# Altium schematic sheet Beaglebone.SchDoc
size A
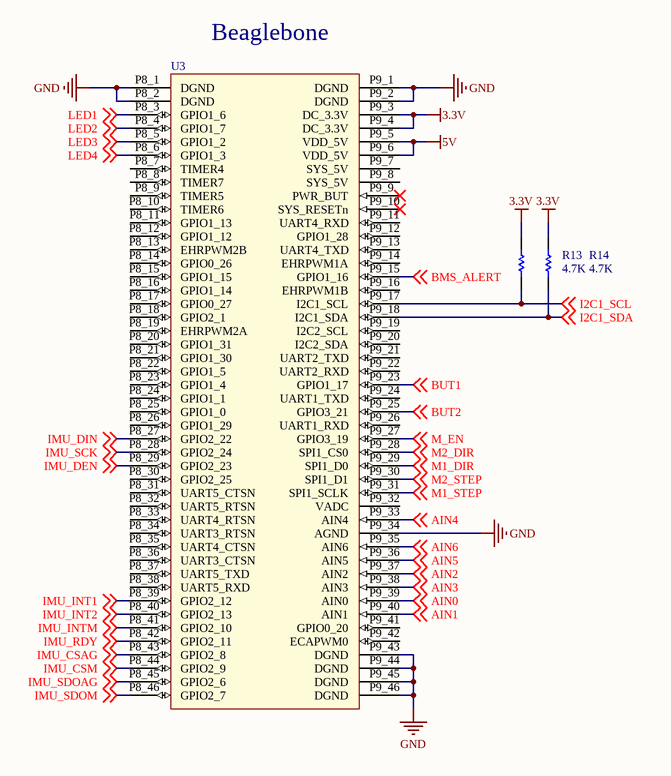
[diagram p0: Beaglebone.SchDoc]

## Parts
R13  value 4.7K  [J1-0603]
R14  value 4.7K  [J1-0603]
U3  Beaglebone Black  [BEAGLEBONE_BLACK]  (value not drawn)

## Nets
3.3V: R13.2 R14.2 U3.P9_3(DC_3.3V) U3.P9_4(DC_3.3V)
5V: U3.P9_5(VDD_5V) U3.P9_6(VDD_5V)
GND: U3.P8_1(DGND) U3.P8_2(DGND) U3.P9_1(DGND) U3.P9_2(DGND) U3.P9_34(AGND) U3.P9_43(DGND) U3.P9_44(DGND) U3.P9_45(DGND) U3.P9_46(DGND)
AIN0: U3.P9_39(AIN0) ; off-sheet AIN0
AIN1: U3.P9_40(AIN1) ; off-sheet AIN1
AIN2: U3.P9_37(AIN2) ; off-sheet AIN2
AIN3: U3.P9_38(AIN3) ; off-sheet AIN3
AIN4: U3.P9_33(AIN4) ; off-sheet AIN4
AIN5: U3.P9_36(AIN5) ; off-sheet AIN5
AIN6: U3.P9_35(AIN6) ; off-sheet AIN6
BMS_ALERT: U3.P9_15(GPIO1_16) ; off-sheet BMS_ALERT
BUT1: U3.P9_23(GPIO1_17) ; off-sheet BUT1
BUT2: U3.P9_25(GPIO3_21) ; off-sheet BUT2
I2C1_SCL: R13.1 U3.P9_17(I2C1_SCL) ; off-sheet I2C1_SCL
I2C1_SDA: R14.1 U3.P9_18(I2C1_SDA) ; off-sheet I2C1_SDA
IMU_CSAG: U3.P8_43(GPIO2_8) ; off-sheet IMU_CSAG
IMU_CSM: U3.P8_44(GPIO2_9) ; off-sheet IMU_CSM
IMU_DEN: U3.P8_29(GPIO2_23) ; off-sheet IMU_DEN
IMU_DIN: U3.P8_27(GPIO2_22) ; off-sheet IMU_DIN
IMU_INT1: U3.P8_39(GPIO2_12) ; off-sheet IMU_INT1
IMU_INT2: U3.P8_40(GPIO2_13) ; off-sheet IMU_INT2
IMU_INTM: U3.P8_41(GPIO2_10) ; off-sheet IMU_INTM
IMU_RDY: U3.P8_42(GPIO2_11) ; off-sheet IMU_RDY
IMU_SCK: U3.P8_28(GPIO2_24) ; off-sheet IMU_SCK
IMU_SDOAG: U3.P8_45(GPIO2_6) ; off-sheet IMU_SDOAG
IMU_SDOM: U3.P8_46(GPIO2_7) ; off-sheet IMU_SDOM
LED1: U3.P8_3(GPIO1_6) ; off-sheet LED1
LED2: U3.P8_4(GPIO1_7) ; off-sheet LED2
LED3: U3.P8_5(GPIO1_2) ; off-sheet LED3
LED4: U3.P8_6(GPIO1_3) ; off-sheet LED4
M1_DIR: U3.P9_29(SPI1_D0) ; off-sheet M1_DIR
M1_STEP: U3.P9_31(SPI1_SCLK) ; off-sheet M1_STEP
M2_DIR: U3.P9_28(SPI1_CS0) ; off-sheet M2_DIR
M2_STEP: U3.P9_30(SPI1_D1) ; off-sheet M2_STEP
M_EN: U3.P9_27(GPIO3_19) ; off-sheet M_EN

Not connected (* = marked no-connect by the designer): U3 P8_7(TIMER4) P8_8(TIMER7) P8_9(TIMER5) P8_10(TIMER6) P8_11(GPIO1_13) P8_12(GPIO1_12) P8_13(EHRPWM2B) P8_14(GPIO0_26) P8_15(GPIO1_15) P8_16(GPIO1_14) P8_17(GPIO0_27) P8_18(GPIO2_1) P8_19(EHRPWM2A) P8_20(GPIO1_31) P8_21(GPIO1_30) P8_22(GPIO1_5) P8_23(GPIO1_4) P8_24(GPIO1_1) P8_25(GPIO1_0) P8_26(GPIO1_29) P8_30(GPIO2_25) P8_31(UART5_CTSN) P8_32(UART5_RTSN) P8_33(UART4_RTSN) P8_34(UART3_RTSN) P8_35(UART4_CTSN) P8_36(UART3_CTSN) P8_37(UART5_TXD) P8_38(UART5_RXD) P9_7(SYS_5V) P9_8(SYS_5V) P9_9(PWR_BUT)* P9_10(SYS_RESETn)* P9_11(UART4_RXD) P9_12(GPIO1_28) P9_13(UART4_TXD) P9_14(EHRPWM1A) P9_16(EHRPWM1B) P9_19(I2C2_SCL) P9_20(I2C2_SDA) P9_21(UART2_TXD) P9_22(UART2_RXD) P9_24(UART1_TXD) P9_26(UART1_RXD) P9_32(VADC) P9_41(GPIO0_20) P9_42(ECAPWM0)

## Notes on the sheet
- (near U3) Beaglebone

## Library data of the parts
R13 R14 = Res1: RES SMD 4.7K OHM 5% 1/10W 0603; Supplier Part Number 1: 311-4.7KGRCT-ND; Supplier 1: Digi-Key